# Altium schematic sheet Sensing.SchDoc
size A4
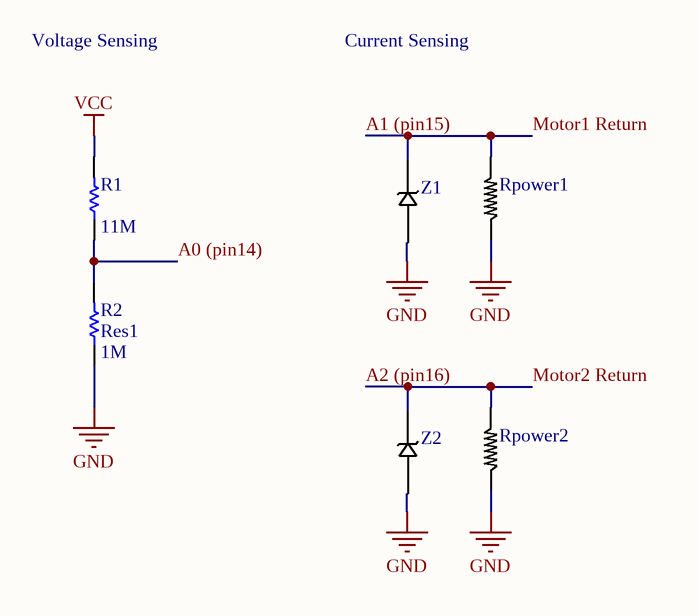
[diagram p0: Sensing.SchDoc]

## Parts
R1  value 11M  [AXIAL-0.3]  (hidden comment: Res1)
R2  Res1  value 1M  [AXIAL-0.3]
Rpower1  SQP500 Power Resistor  [SQP500 Power Resistor]  (value not drawn)
Rpower2  SQP500 Power Resistor  [SQP500 Power Resistor]  (value not drawn)
Z1  Zener, 1.5W, 3.3V, 1SMA5913BT3G  (value not drawn)
Z2  Zener, 1.5W, 3.3V, 1SMA5913BT3G  (value not drawn)

## Nets
GND: R2.1 Rpower1.?2 Rpower2.?2 Z1.?1 Z2.?1
VCC: R1.2
A0 (pin14): R1.1 R2.2
A1 (pin15): Rpower1.?1 Z1.4  [also labelled Motor1 Return]
A2 (pin16): Rpower2.?1 Z2.4  [also labelled Motor2 Return]

## Notes on the sheet
- Voltage Sensing
- Current Sensing

## Library data of the parts
R1 R2 = Res1: Resistor; Published: 8-Jun-2000; LatestRevisionDate: 17-Jul-2002; LatestRevisionNote: Re-released for DXP Platform.; PackageReference: AXIAL-0.3; Publisher: Altium Limited; PackageDescription: Axial Device, Thru-Hole; 2 Leads; 0.3 in Pin Spacing